# EAGLE schematic k01 (EAGLE 8.7.0)
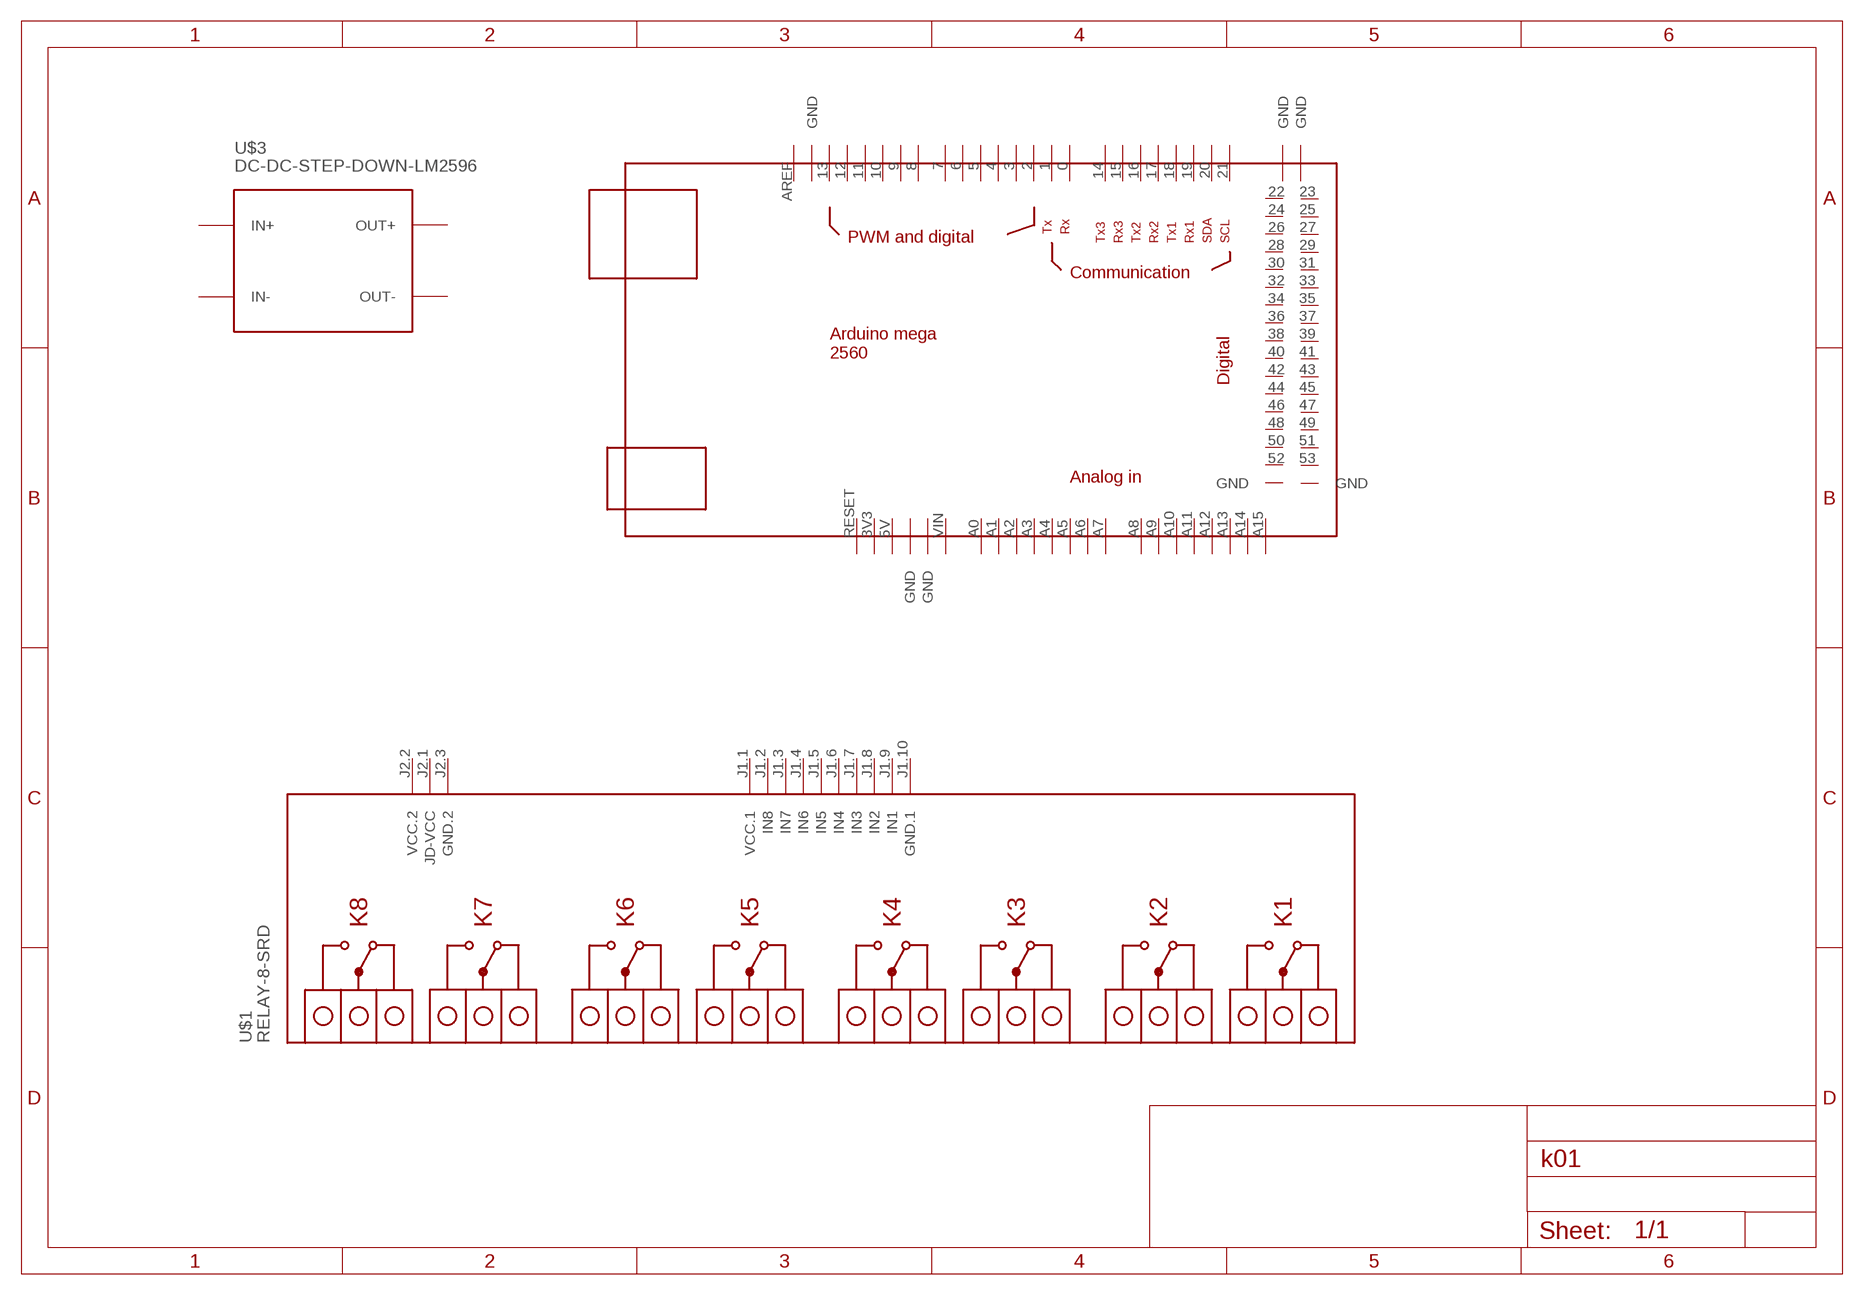
[diagram p0: schematic, sheet 1]

## Parts
U$1  RELAY-8-SRD  [RELAY-8-SRD]
U$2  MEGA_DEVICE  [MEGAOUTLINE]
U$3  DC-DC-STEP-DOWN-LM2596  [DC-DC-STEP-DOWN-LM2596]
Unconnected: U$1.J1.2(IN8) U$1.J1.3(IN7) U$1.J1.4(IN6) U$1.J1.5(IN5) U$1.J1.6(IN4) U$1.J1.7(IN3) U$1.J1.8(IN2) U$1.J1.9(IN1) U$1.J2.1(JD-VCC) U$2.0 U$2.1 U$2.2 U$2.3 U$2.3V3 U$2.4 U$2.5 U$2.5V U$2.6 U$2.7 U$2.8 U$2.9 U$2.10 U$2.11 U$2.12 U$2.13 U$2.14 U$2.15 U$2.16 U$2.17 U$2.18 U$2.19 U$2.20 U$2.21 U$2.22 U$2.23 U$2.24 U$2.25 U$2.26 U$2.27 U$2.28 U$2.29 U$2.30 U$2.31 U$2.32 U$2.33 U$2.34 U$2.35 U$2.36 U$2.37 U$2.38 U$2.39 U$2.40 U$2.41 U$2.42 U$2.43 U$2.44 U$2.45 U$2.46 U$2.47 U$2.48 U$2.49 U$2.50 U$2.51 U$2.52 U$2.53 U$2.A0 U$2.A1 U$2.A2 U$2.A3 U$2.A4 U$2.A5 U$2.A6 U$2.A7 U$2.A8 U$2.A9 U$2.A10 U$2.A11 U$2.A12 U$2.A13 U$2.A14 U$2.A15 U$2.AREF U$2.GND@1(GND) U$2.GND@2(GND) U$2.GND@3(GND) U$2.GND@4(GND) U$2.GND@5(GND) U$2.GND@6(GND) U$2.GND@7(GND) U$2.RESET U$2.VIN U$3.IN+ U$3.IN- U$3.OUT+ U$3.OUT-

## Power pins joined to a net without a drawn wire
GND.1: U$1.J1.10(GND.1)
GND.2: U$1.J2.3(GND.2)
VCC.1: U$1.J1.1(VCC.1)
VCC.2: U$1.J2.2(VCC.2)

## Library data of the parts
U$1 = diy-modules:RELAY-8-SRD: 8-Channel Relay Module based on SRD-05VDC-SL-C relays Click here to find device on ebay.com <http://www.ebay.com/sch/eight+channel+relay+module+optocoupler+5v>
U$2 = ArduinoMegaOutline:MEGA_DEVICE: mega card as device
U$3 = diy-modules:DC-DC-STEP-DOWN-LM2596: DC/DC Step-Down Regulator based on LM2596-ADJ chip LM2596 datasheet available here: http://www.ti.com/lit/ds/symlink/lm2596.pdf Click here to find device on ebay.com <http://www.ebay.com/sch/lm2596+power+regulator>